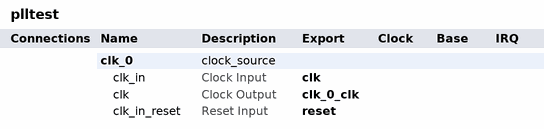
[diagram p0: system contents]
# Platform Designer (Qsys) system plltest, MAX II EPM240T100C5
# Parameters at their usual value, and those the tool derives, are not listed.
package require -exact qsys 13.1
create_system plltest
set_project_property DEVICE_FAMILY {MAX II}
set_project_property DEVICE EPM240T100C5

add_instance clk_0 clock_source 13.1
set_instance_parameter_value clk_0 clockFrequency 3579545

# exported interfaces
add_interface clk clock sink
set_interface_property clk EXPORT_OF clk_0.clk_in
add_interface reset reset sink
set_interface_property reset EXPORT_OF clk_0.clk_in_reset
add_interface clk_0_clk clock source
set_interface_property clk_0_clk EXPORT_OF clk_0.clk

set_interconnect_requirement {$system} qsys_mm.clockCrossingAdapter HANDSHAKE
set_interconnect_requirement {$system} qsys_mm.maxAdditionalLatency 1
set_interconnect_requirement {$system} qsys_mm.insertDefaultSlave false

save_system plltest.qsys
